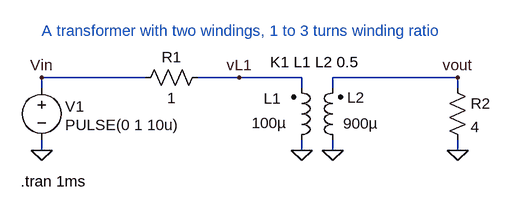
[diagram p0: schematic Transformer.asc]
Transformer.asc, the LTspice schematic file:
Version 4
SHEET 1 880 680
WIRE -128 176 -288 176
WIRE 16 176 -48 176
WIRE 112 176 16 176
WIRE 352 176 160 176
WIRE -288 192 -288 176
WIRE 112 192 112 176
WIRE 160 192 160 176
WIRE 352 192 352 176
WIRE -288 288 -288 272
WIRE 112 288 112 272
WIRE 160 288 160 272
WIRE 352 288 352 272
FLAG -288 288 0
FLAG 160 288 0
FLAG 112 288 0
FLAG 352 288 0
FLAG -288 176 Vin
FLAG 352 176 vout
FLAG 16 176 vL1
SYMBOL ind2 96 288 M180
WINDOW 0 -15 80 Right 0
WINDOW 3 -7 42 Right 0
SYMATTR InstName L1
SYMATTR Value 100µ
SYMATTR Type ind
SYMBOL ind2 176 288 R180
WINDOW 0 -33 81 Left 0
WINDOW 3 -54 41 Left 0
SYMATTR InstName L2
SYMATTR Value 900µ
SYMATTR Type ind
SYMBOL res -32 160 R90
WINDOW 0 0 56 VBottom 0
WINDOW 3 32 56 VTop 0
SYMATTR InstName R1
SYMATTR Value 1
SYMBOL res 336 176 R0
SYMATTR InstName R2
SYMATTR Value 4
SYMBOL voltage -288 176 R0
WINDOW 123 0 0 Left 0
WINDOW 39 0 0 Left 0
WINDOW 0 36 45 Left 0
WINDOW 3 36 73 Left 0
SYMATTR InstName V1
SYMATTR Value PULSE(0 1 10u)
TEXT 64 152 Left 0 !K1 L1 L2 0.5
TEXT -320 336 Left 0 !.tran 1ms
TEXT -288 104 Left 0 ;A transformer with two windings, 1 to 3 turns winding ratio

The netlist it stands for:
* Transformer.asc
L1 0 vL1 100µ
L2 0 vout 900µ
R1 vL1 Vin 1
R2 vout 0 4
V1 Vin 0 PULSE(0 1 10u)
K1 L1 L2 0.5
.tran 1ms
* A transformer with two windings, 1 to 3 turns winding ratio
.backanno
.end